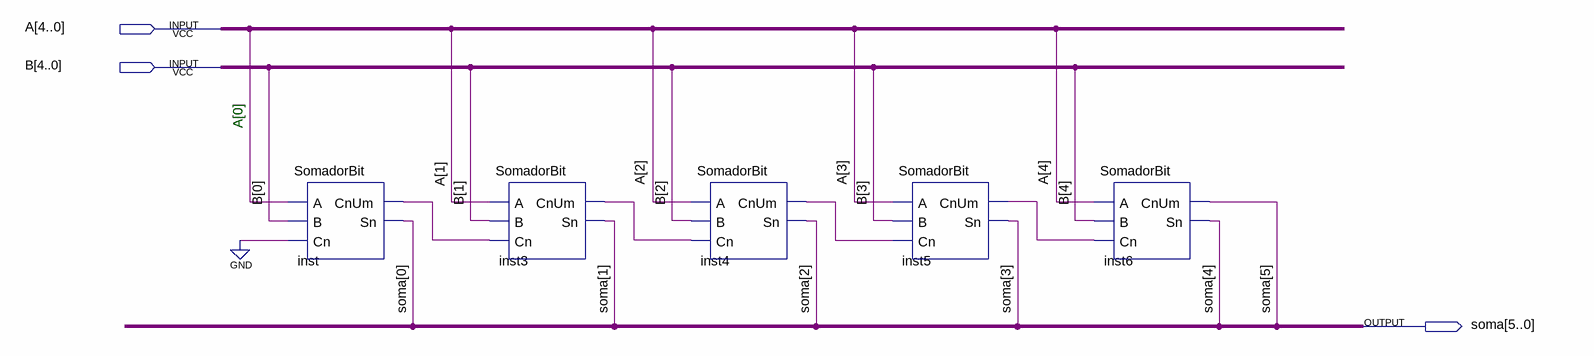
[diagram p0: schematic sheet]
// Quartus schematic somador.bdf as structural Verilog: 5 symbols, 3 pins
module somador (
  input  [4:0] A,
  input  [4:0] B,
  output [5:0] soma
);

  wire inst3_cnum, inst4_cnum, inst5_cnum, inst_cnum;

  SomadorBit inst (.A(A[0]), .B(B[0]), .Cn(1'b0), .CnUm(inst_cnum), .Sn(soma[0]));
  SomadorBit inst3 (.A(A[1]), .B(B[1]), .Cn(inst_cnum), .CnUm(inst3_cnum), .Sn(soma[1]));
  SomadorBit inst4 (.A(A[2]), .B(B[2]), .Cn(inst3_cnum), .CnUm(inst4_cnum), .Sn(soma[2]));
  SomadorBit inst5 (.A(A[3]), .B(B[3]), .Cn(inst4_cnum), .CnUm(inst5_cnum), .Sn(soma[3]));
  SomadorBit inst6 (.A(A[4]), .B(B[4]), .Cn(inst5_cnum), .CnUm(soma[5]), .Sn(soma[4]));

  // Notes on the sheet:
  //   A[0]
endmodule
